# Altium schematic sheet Boost_stage_pwm_controller.SchDoc
size A4
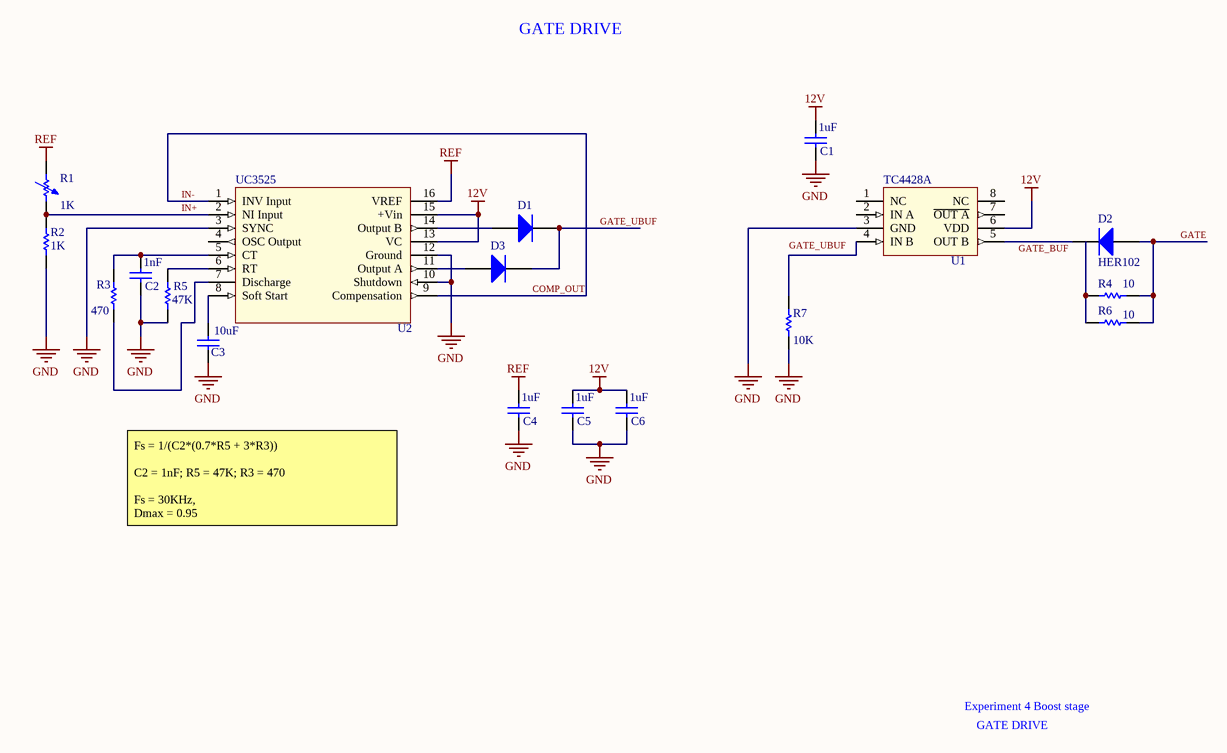
[diagram p0: Boost_stage_pwm_controller.SchDoc]

## Parts
C1  value 1uF  [RAD-0.3]  (hidden comment: Cap)
C2  value 1nF  [RAD-0.3]  (hidden comment: Cap)
C3  value 10uF  [RAD-0.3]  (hidden comment: Cap)
C4  value 1uF  [RAD-0.3]  (hidden comment: Cap)
C5  value 1uF  [RAD-0.3]  (hidden comment: Cap)
C6  value 1uF  [RAD-0.3]  (hidden comment: Cap)
D1  Diode  [SMC]  (value not drawn)
D2  HER102  [SMC]
D3  Diode  [SMC]  (value not drawn)
R1  value 1K  [AXIAL-0.7]  (hidden comment: Res Adj1)
R2  value 1K  [AXIAL-0.3]  (hidden comment: Res1)
R3  value 470  [AXIAL-0.3]  (hidden comment: Res1)
R4  value 10  [AXIAL-0.3]
R5  value 47K  [AXIAL-0.3]  (hidden comment: Res1)
R6  value 10  [AXIAL-0.3]
R7  value 10K  [AXIAL-0.3]
U1  TC4428A
U2  UC3525

## Nets
12V: C1.2 C5.2 C6.2 U1.6(VDD) U2.13(VC) U2.15(+Vin)
GND: C1.1 C2.1 C3.1 C4.1 C5.1 C6.1 R2.1 R5.1 R7.1 U1.3(GND) U2.3(SYNC) U2.10(Shutdown) U2.12(Ground)
REF: C4.2 R1.1 U2.16(VREF)
COMP_OUT: U2.1(INV_Input) U2.9(Compensation)  [also labelled IN-]
GATE: D2.1(A) R4.1 R6.1
GATE_UBUF: D1.2(K) D3.2(K)
IN+: R1.2 R2.2 U2.2(NI_Input)
NetC2_2: C2.2 R3.1 U2.5(CT)
NetC3_2: C3.2 U2.8(Soft_Start)
NetD1_1: D1.1(A) U2.14(Output_B)
NetD2_2: D2.2(K) U1.5(OUT_B)
NetD3_1: D3.1(A) U2.11(Output_A)
NetR3_2: R3.2 U2.7(Discharge)
NetR4_2: R4.2 R6.2
NetR5_2: R5.2 U2.6(RT)
NetR7_2: R7.2 U1.4(IN_B)

Not connected (* = marked no-connect by the designer): U1 1(NC) 2(IN_A) 7(~{OUT_A}) 8(NC); U2 4(OSC_Output)

## Notes on the sheet
- GATE DRIVE
- Fs = 1/(C2*(0.7*R5 + 3*R3))
  C2 = 1nF; R5 = 47K; R3 = 470
  Fs = 30KHz,
  Dmax = 0.95
- Experiment 4 Boost stage
- Labels drawn without touching a wire or pin: GATE_BUF, GATE_UBUF

## Library data of the parts
C1-C6 = Cap: Capacitor; Published: 8-Jun-2000; LatestRevisionDate: 17-Jul-2002; LatestRevisionNote: Re-released for DXP Platform.; PackageReference: RAD-0.3; Publisher: Altium Limited; PackageDescription: Radial Cap, Thru-Hole; 2 Leads; 0.3 in Pin Spacing
D1-D3 = Diode: Default Diode; Published: 8-Jun-2000; LatestRevisionDate: 17-Jul-2002; LatestRevisionNote: Re-released for DXP Platform.; PackageVersion: Sep-1996; PackageReference: SMC; Publisher: Altium Limited; PackageDescription: DO-214-AB/SMC; 2 C-Bend Leads; Body 7.9 x 5.9 mm, inc. leads (LxW); Code_JEDEC: DO-214-AB
R1 = Res Adj1: Variable Resistor; Set Position: 0.5; Published: 8-Jun-2000; LatestRevisionDate: 17-Jul-2002; LatestRevisionNote: Re-released for DXP Platform.; PackageReference: AXIAL-0.7; Publisher: Altium Limited; PackageDescription: Axial Device, Thru-Hole; 2 Leads; 0.7 in Pin Spacing
R2-R7 = Res1: Resistor; Published: 8-Jun-2000; LatestRevisionDate: 17-Jul-2002; LatestRevisionNote: Re-released for DXP Platform.; PackageReference: AXIAL-0.3; Publisher: Altium Limited; PackageDescription: Axial Device, Thru-Hole; 2 Leads; 0.3 in Pin Spacing